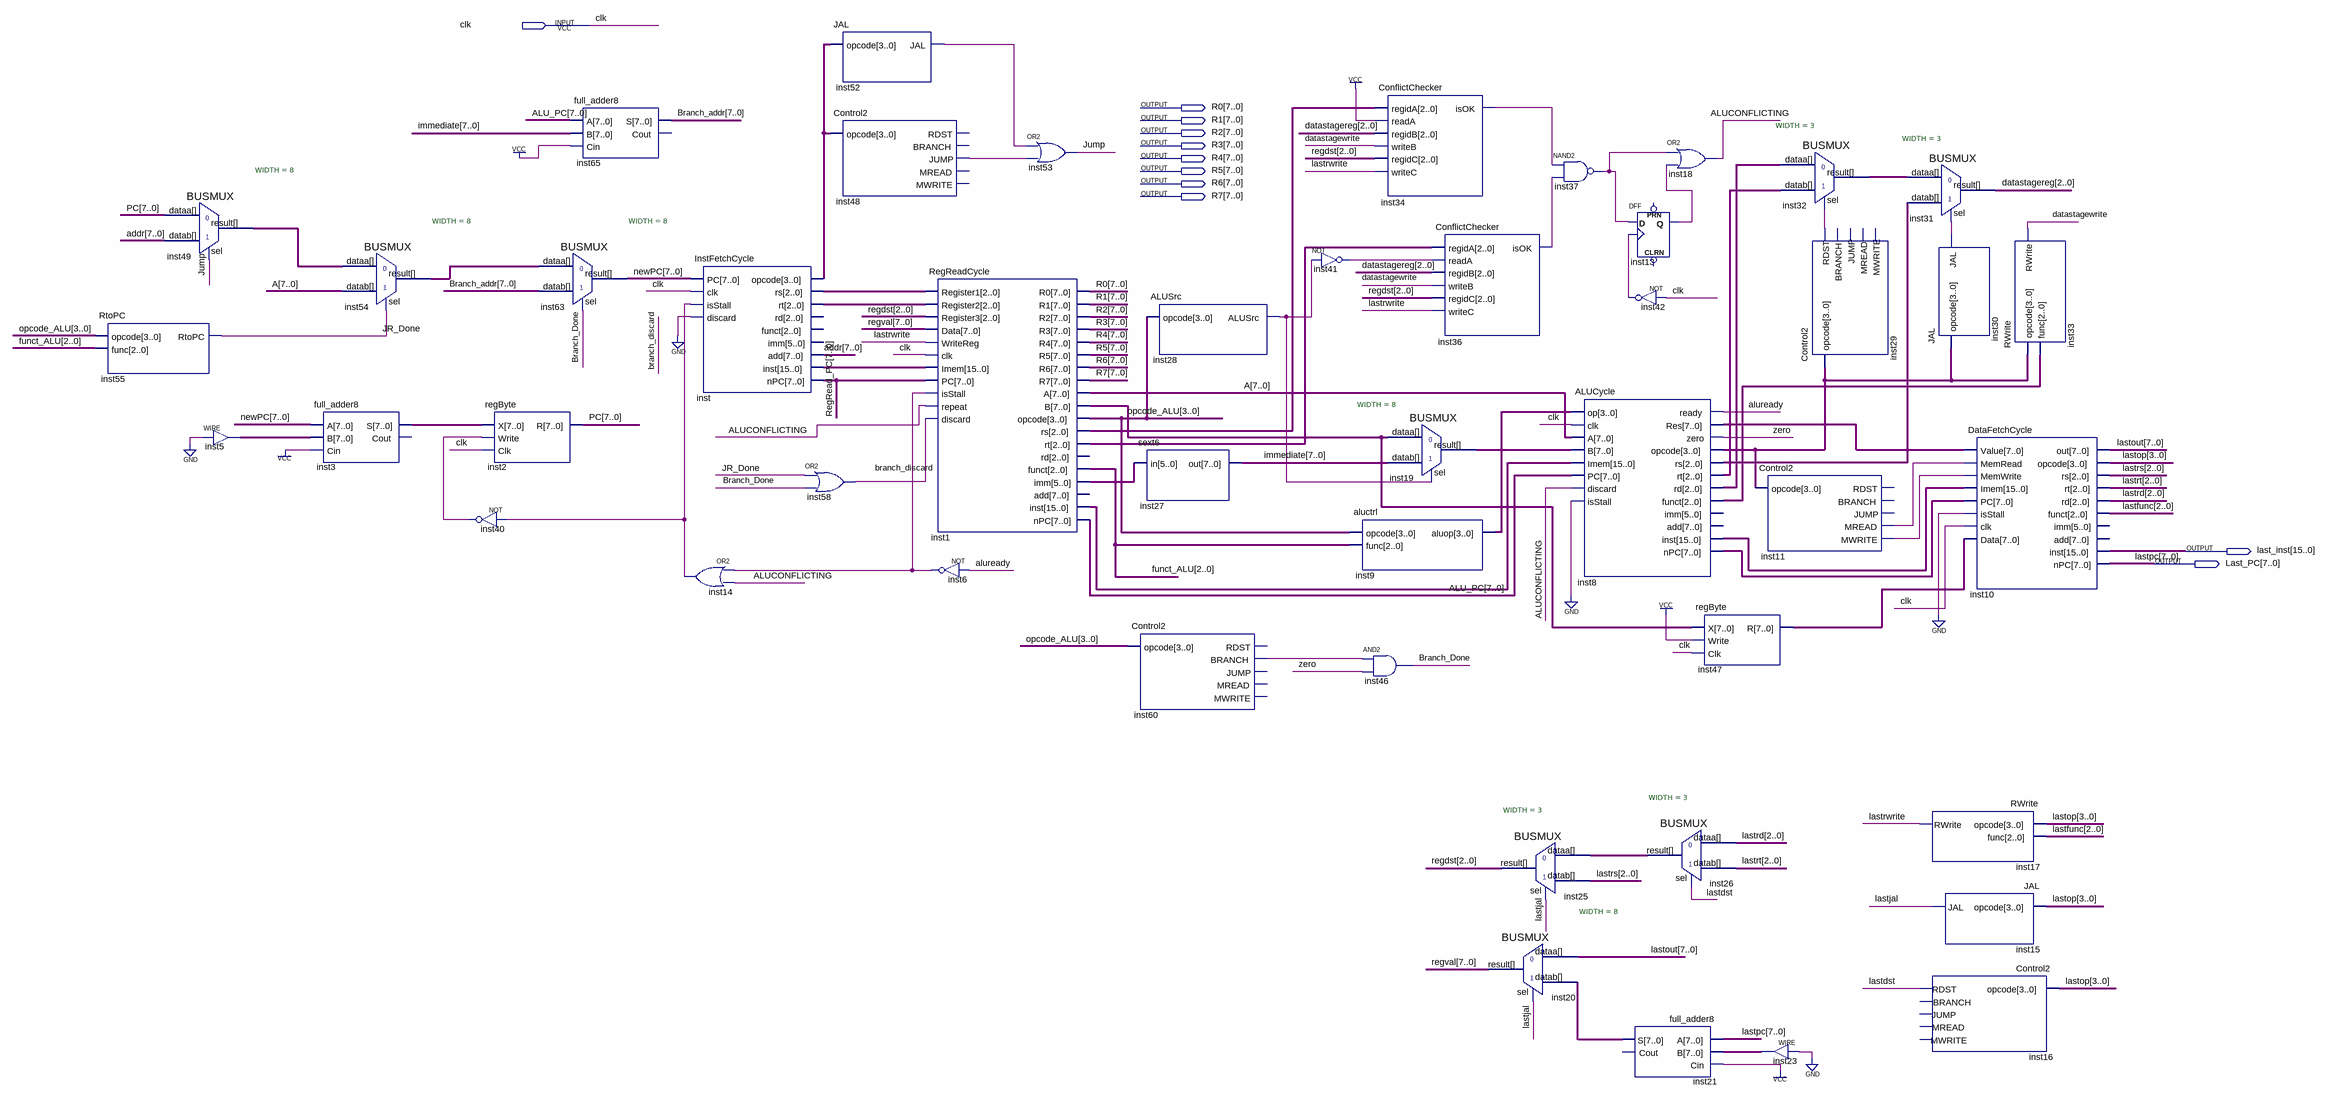
[diagram p0: schematic sheet]
// Quartus schematic PipelineCPU.bdf as structural Verilog: 47 symbols, 11 pins
module PipelineCPU (
  input  clk,
  output [7:0] R0,
  output [7:0] R1,
  output [7:0] R2,
  output [7:0] R3,
  output [7:0] R4,
  output [7:0] R5,
  output [7:0] R6,
  output [7:0] R7,
  output [15:0] last_inst,
  output [7:0] Last_PC
);

  wire ALUCONFLICTING, aluready, branch_discard, Branch_Done, datastagewrite, inst6_out, inst11_mread,
       inst11_mwrite, inst13_q, inst14_out, inst28_alusrc, inst29_rdst, inst30_jal, inst34_isok, inst36_isok,
       inst37_out, inst40_out, inst41_out, inst42_out, inst48_jump, inst52_jal, inst60_branch, JR_Done, Jump,
       lastdst, lastjal, lastrwrite, zero;
  wire [2:0] datastagereg, funct_ALU, inst1_rs, inst1_rt, inst8_funct, inst8_rd, inst8_rs, inst8_rt,
       inst26_result, inst32_result, inst_rs, inst_rt, lastfunc, lastrd, lastrs, lastrt, regdst;
  wire [3:0] inst8_opcode, inst9_aluop, inst_opcode, lastop, opcode_ALU;
  wire [5:0] inst1_imm;
  wire [7:0] A, addr, ALU_PC, Branch_addr, immediate, inst1_b, inst3_s, inst5_out, inst8_npc, inst8_res,
       inst19_result, inst21_s, inst23_out, inst47_r, inst49_result, inst54_result, lastout, newPC, PC,
       RegRead_PC, regval;
  wire [15:0] inst1_inst, inst8_inst, inst_inst;

  RtoPC inst55 (.opcode(opcode_ALU), .func(funct_ALU), .RtoPC(JR_Done));
  BUSMUX #(.WIDTH(8)) inst49 (.datab(addr), .sel(Jump), .dataa(PC), .result(inst49_result));
  assign inst5_out = {8{1'b0}};  // WIRE inst5
  full_adder8 inst3 (.A(newPC), .B(inst5_out), .Cin(1'b1), .S(inst3_s));  // open: Cout
  BUSMUX #(.WIDTH(8)) inst54 (.datab(A), .sel(JR_Done), .dataa(inst49_result), .result(inst54_result));
  regByte inst2 (.X(inst3_s), .Write(inst40_out), .Clk(clk), .R(PC));
  not inst40 (inst40_out, inst14_out);
  BUSMUX #(.WIDTH(8)) inst63 (.datab(Branch_addr), .sel(Branch_Done), .dataa(inst54_result), .result(newPC));
  full_adder8 inst65 (.A(ALU_PC), .B(immediate), .Cin(1'b1), .S(Branch_addr));  // open: Cout
  InstFetchCycle inst (
    .PC(newPC), .clk(clk), .isStall(inst14_out), .discard(1'b0), .opcode(inst_opcode), .rs(inst_rs),
    .rt(inst_rt), .add(addr), .inst(inst_inst), .nPC(RegRead_PC));  // open: rd, funct, imm
  or inst14 (inst14_out, inst6_out, ALUCONFLICTING);
  or inst58 (branch_discard, JR_Done, Branch_Done);
  JAL inst52 (.opcode(inst_opcode), .JAL(inst52_jal));
  Control2 inst48 (.opcode(inst_opcode), .JUMP(inst48_jump));  // open: RDST, BRANCH, MREAD, MWRITE
  RegReadCycle inst1 (
    .Register1(inst_rs), .Register2(inst_rt), .Register3(regdst), .Data(regval), .WriteReg(lastrwrite),
    .clk(clk), .Imem(inst_inst), .PC(RegRead_PC), .isStall(inst6_out), .\repeat (ALUCONFLICTING),
    .discard(branch_discard), .R0(R0), .R1(R1), .R2(R2), .R3(R3), .R4(R4), .R5(R5), .R6(R6), .R7(R7), .A(A),
    .B(inst1_b), .opcode(opcode_ALU), .rs(inst1_rs), .rt(inst1_rt), .funct(funct_ALU), .imm(inst1_imm),
    .inst(inst1_inst), .nPC(ALU_PC));  // open: rd, add
  not inst6 (inst6_out, aluready);
  or inst53 (Jump, inst52_jal, inst48_jump);
  ALUSrc inst28 (.opcode(opcode_ALU), .ALUSrc(inst28_alusrc));
  sext6 inst27 (.in(inst1_imm), .out(immediate));
  Control2 inst60 (.opcode(opcode_ALU), .BRANCH(inst60_branch));  // open: RDST, JUMP, MREAD, MWRITE
  not inst41 (inst41_out, inst28_alusrc);
  ConflictChecker inst34 (
    .regidA(inst1_rs), .readA(1'b1), .regidB(datastagereg), .writeB(datastagewrite), .regidC(regdst),
    .writeC(lastrwrite), .isOK(inst34_isok));
  aluctrl inst9 (.opcode(opcode_ALU), .func(funct_ALU), .aluop(inst9_aluop));
  and inst46 (Branch_Done, inst60_branch, zero);
  BUSMUX #(.WIDTH(8)) inst19 (.datab(immediate), .sel(inst28_alusrc), .dataa(inst1_b), .result(inst19_result));
  ConflictChecker inst36 (
    .regidA(inst1_rt), .readA(inst41_out), .regidB(datastagereg), .writeB(datastagewrite), .regidC(regdst),
    .writeC(lastrwrite), .isOK(inst36_isok));
  BUSMUX #(.WIDTH(3)) inst25 (.datab(lastrs), .sel(lastjal), .dataa(inst26_result), .result(regdst));
  BUSMUX #(.WIDTH(8)) inst20 (.datab(inst21_s), .sel(lastjal), .dataa(lastout), .result(regval));
  nand inst37 (inst37_out, inst34_isok, inst36_isok);
  ALUCycle inst8 (
    .op(inst9_aluop), .clk(clk), .A(A), .B(inst19_result), .Imem(inst1_inst), .PC(ALU_PC),
    .discard(ALUCONFLICTING), .isStall(1'b0), .ready(aluready), .Res(inst8_res), .zero(zero),
    .opcode(inst8_opcode), .rs(inst8_rs), .rt(inst8_rt), .rd(inst8_rd), .funct(inst8_funct),
    .inst(inst8_inst), .nPC(inst8_npc));  // open: imm, add
  DFF inst13 (.CLK(inst42_out), .D(inst37_out), .Q(inst13_q));  // open: CLRN, PRN
  not inst42 (inst42_out, clk);
  full_adder8 inst21 (.A(Last_PC), .B(inst23_out), .Cin(1'b1), .S(inst21_s));  // open: Cout
  or inst18 (ALUCONFLICTING, inst37_out, inst13_q);
  BUSMUX #(.WIDTH(3)) inst26 (.datab(lastrt), .sel(lastdst), .dataa(lastrd), .result(inst26_result));
  regByte inst47 (.X(inst1_b), .Write(1'b1), .Clk(clk), .R(inst47_r));
  BUSMUX #(.WIDTH(3)) inst32 (.datab(inst8_rt), .sel(inst29_rdst), .dataa(inst8_rd), .result(inst32_result));
  Control2 inst11 (.opcode(inst8_opcode), .MREAD(inst11_mread), .MWRITE(inst11_mwrite));  // open: RDST, BRANCH, JUMP
  assign inst23_out = {8{1'b0}};  // WIRE inst23
  Control2 inst29 (.opcode(inst8_opcode), .RDST(inst29_rdst));  // open: BRANCH, JUMP, MREAD, MWRITE
  BUSMUX #(.WIDTH(3)) inst31 (.datab(inst8_rs), .sel(inst30_jal), .dataa(inst32_result), .result(datastagereg));
  JAL inst30 (.opcode(inst8_opcode), .JAL(inst30_jal));
  RWrite inst17 (.opcode(lastop), .func(lastfunc), .RWrite(lastrwrite));
  JAL inst15 (.opcode(lastop), .JAL(lastjal));
  Control2 inst16 (.opcode(lastop), .RDST(lastdst));  // open: BRANCH, JUMP, MREAD, MWRITE
  DataFetchCycle inst10 (
    .Value(inst8_res), .MemRead(inst11_mread), .MemWrite(inst11_mwrite), .Imem(inst8_inst), .PC(inst8_npc),
    .isStall(1'b0), .clk(clk), .Data(inst47_r), .out(lastout), .opcode(lastop), .rs(lastrs), .rt(lastrt),
    .rd(lastrd), .funct(lastfunc), .inst(last_inst), .nPC(Last_PC));  // open: imm, add
  RWrite inst33 (.opcode(inst8_opcode), .func(inst8_funct), .RWrite(datastagewrite));

  // Other names for the same wires on the sheet: lastpc[7:0] = Last_PC
endmodule
